# EAGLE schematic BeoModern_schemat (EAGLE 8.6.3)
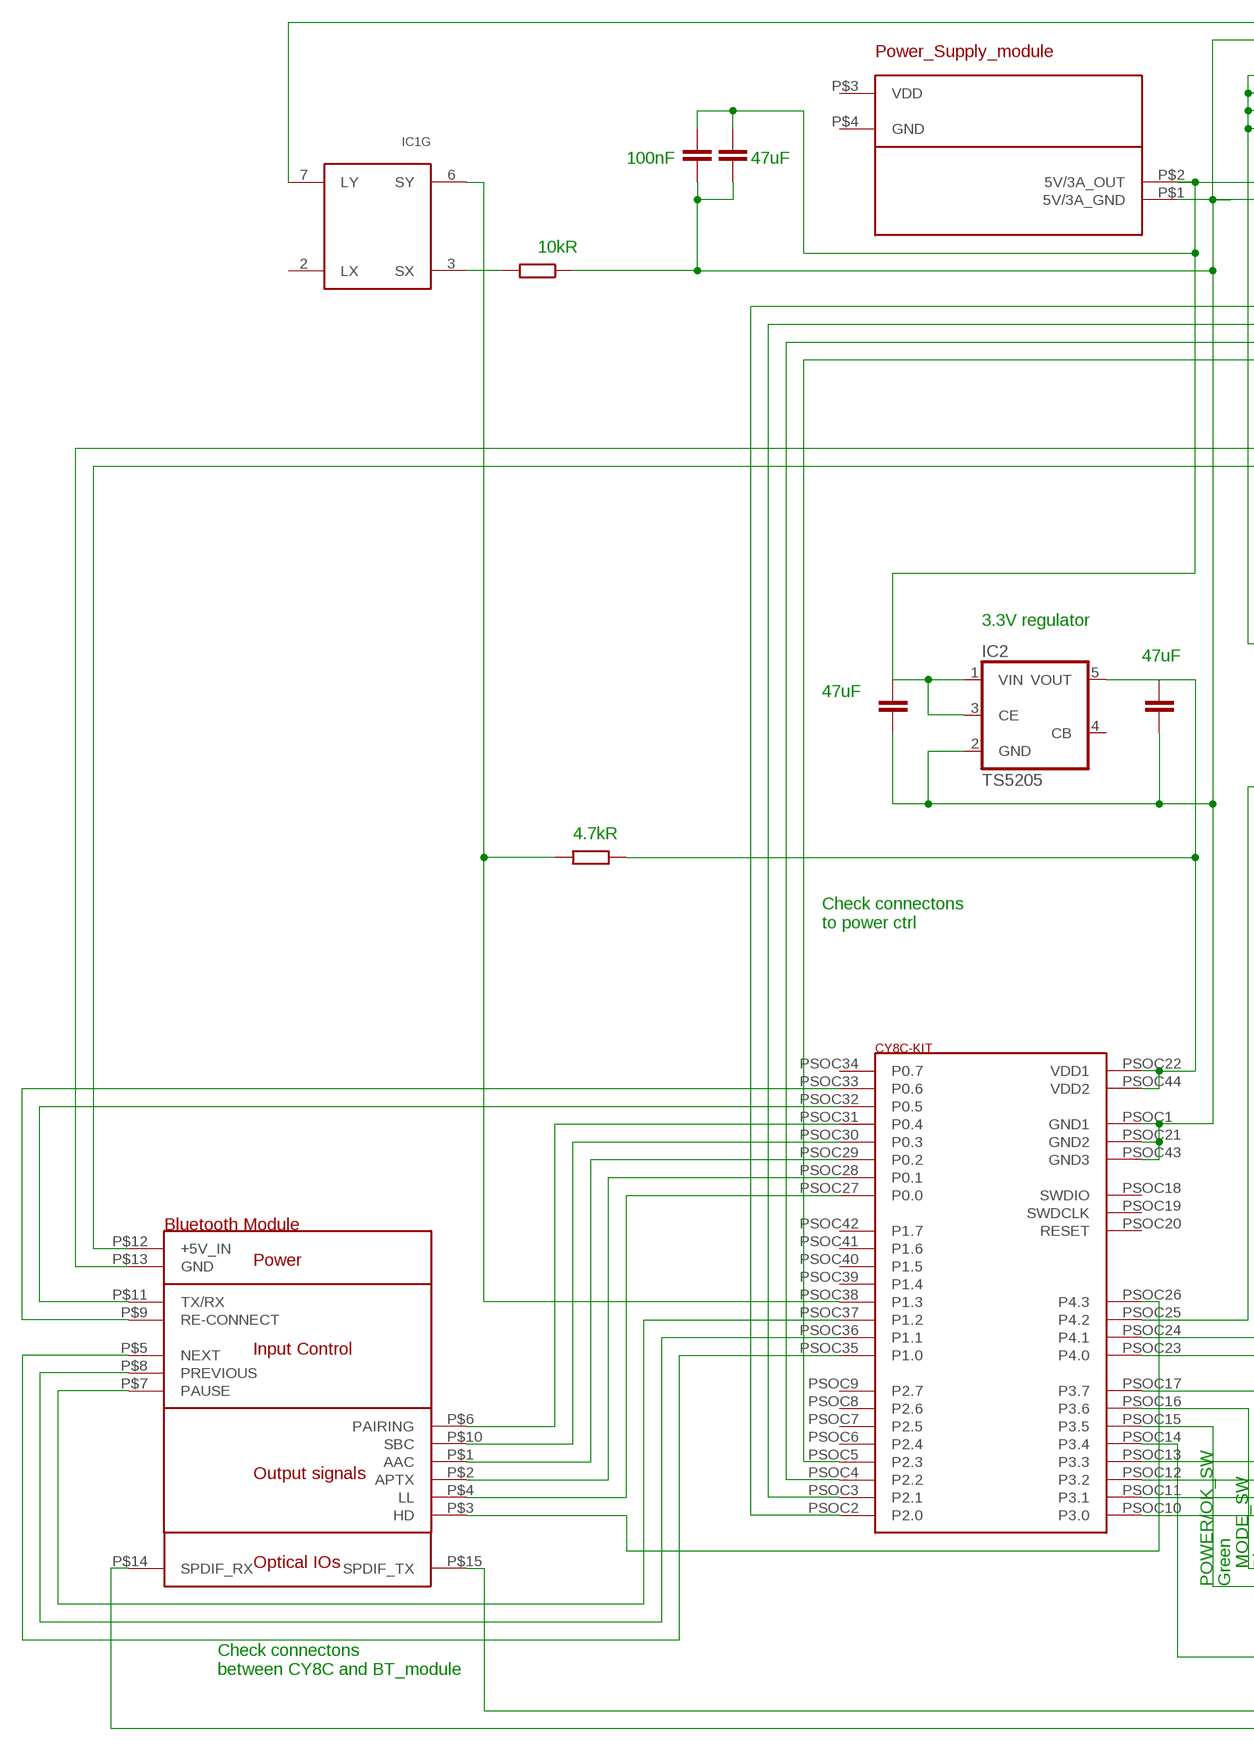
[diagram p0: schematic, sheet 1, part 1 of 2]
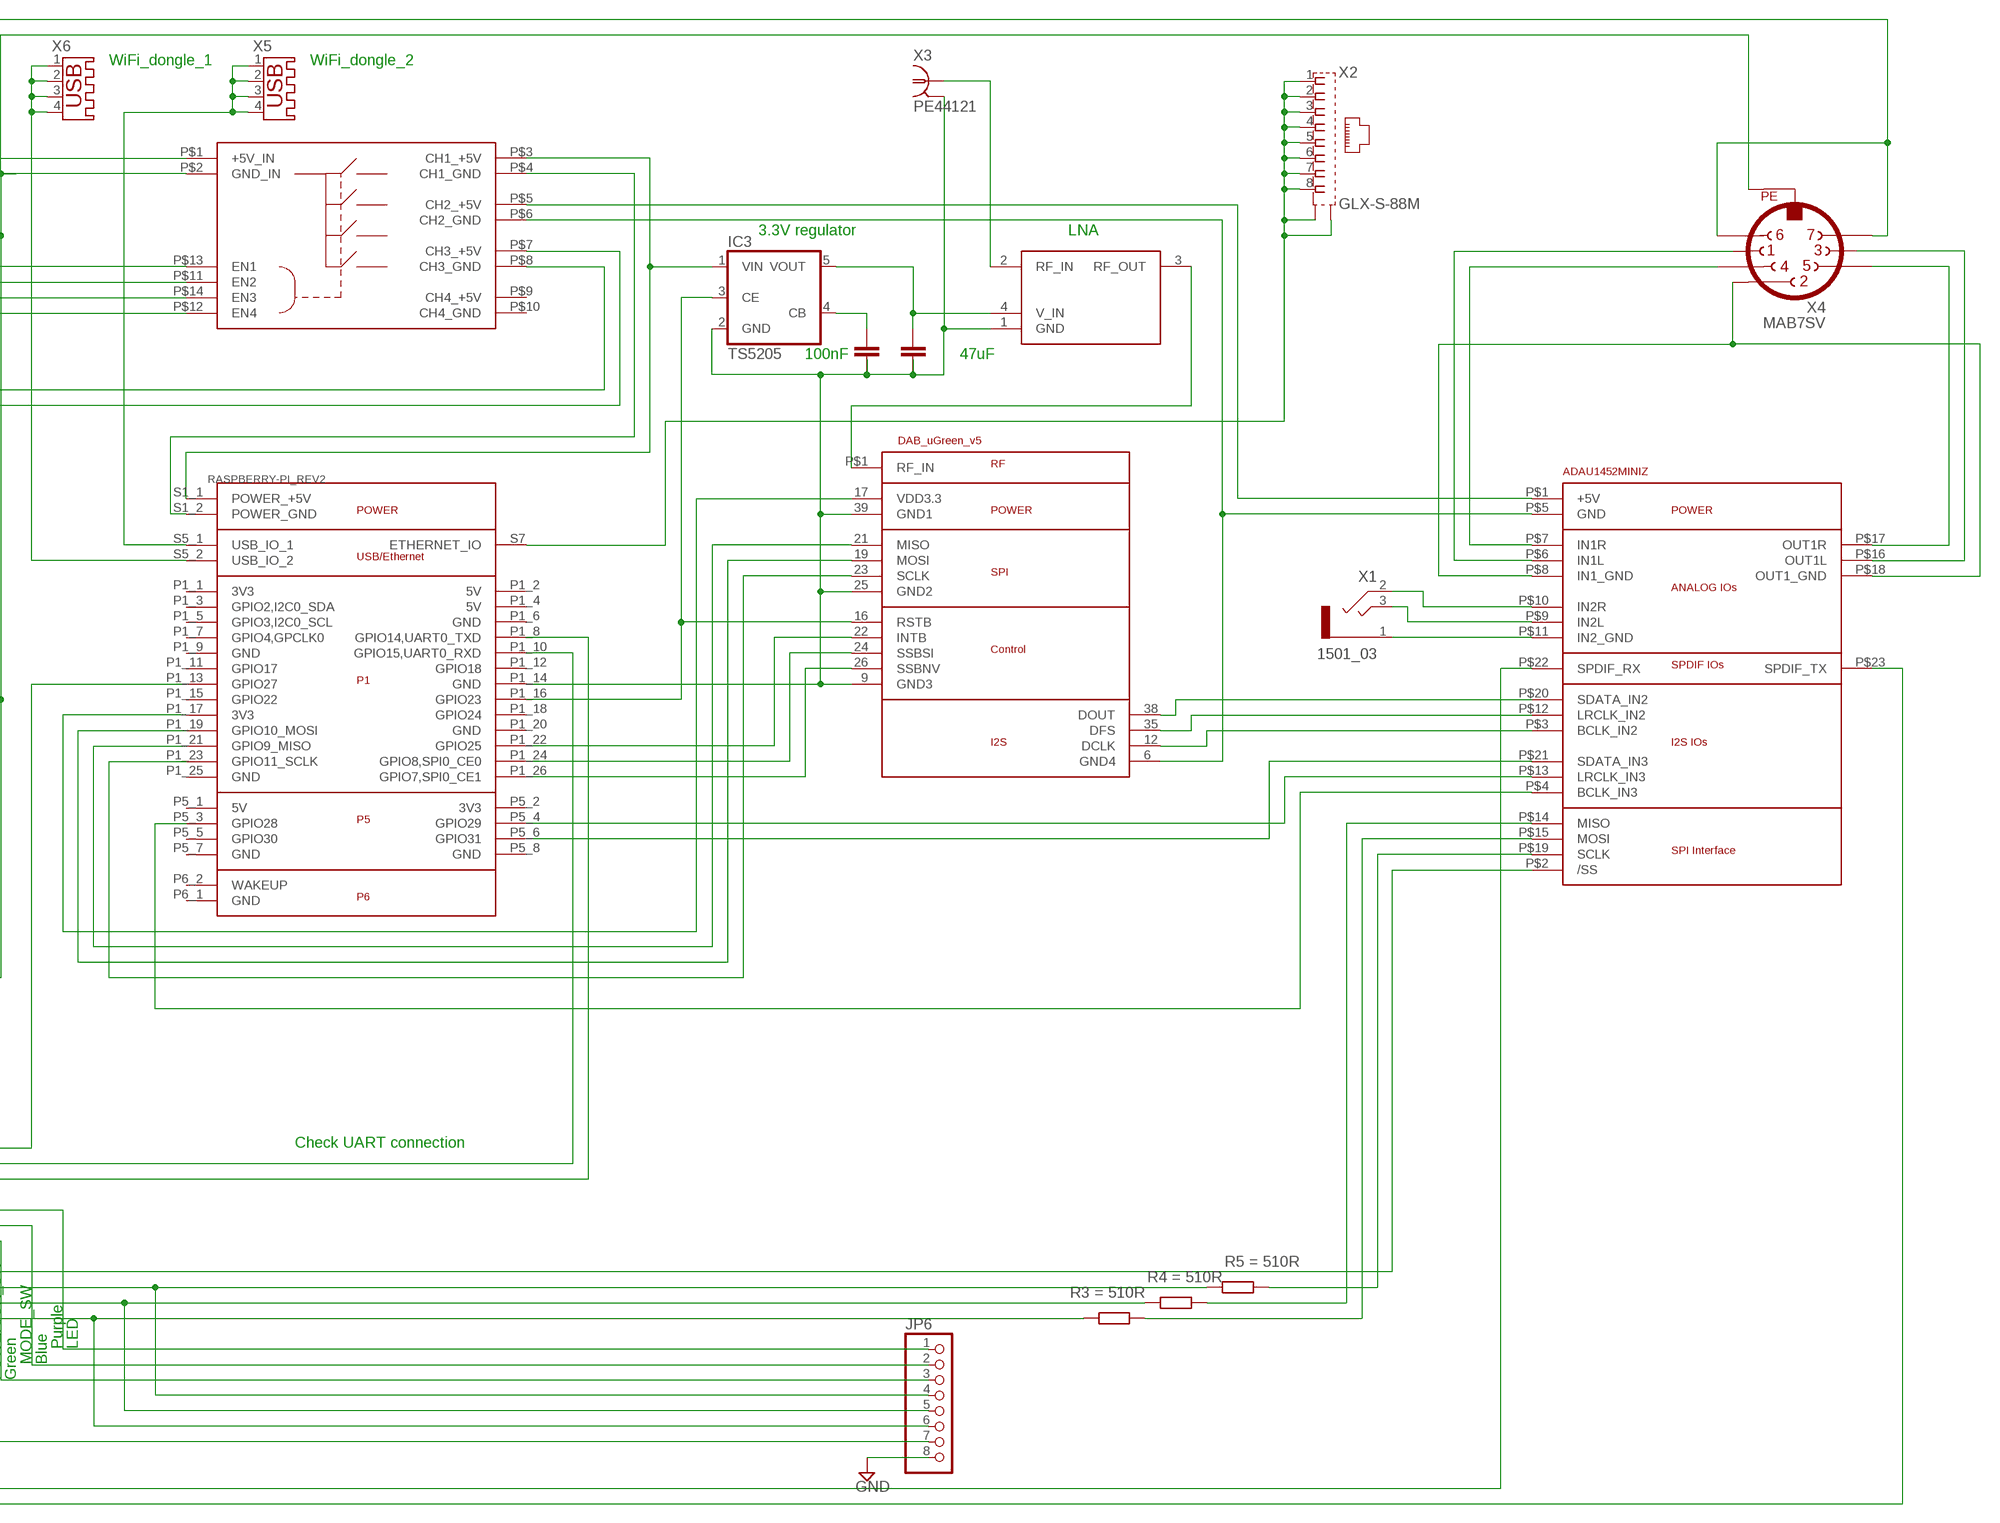
[diagram p1: schematic, sheet 1, part 2 of 2]
R3 (R): R3: 510R
R4 (R): R4: 510R
R5 (R): R5: 510R

## Parts
IC1  82B715TD  [SO8]
IC2  TS5205  [SOT25]
IC3  TS5205  [SOT25]
JP6  PINHD-1X8  [1X08]
U$1  RASPBERRY-PI_REV2  [RASPBERRY-PI_REV2]
U$2  ADAU1452MINIZ  [ADAU1452MINIZ]
U$3  5V_PSU_MODULE  [5V_PSU_MODULE]
U$4  PSU_SWITCH  [PSU_SWITCH]
U$5  DAB_UGREEN_V5  [DAB_UGREEN_V5]
U$6  CY8C-KIT  [CY8C-KIT-FOOTPRINT]
U$7  LNA  [LNA-FOOTPRINT]
U$8  BT_MODULE  [BT_MODULE_FOOTPRINT]
X1  1501_03  [1501_03]
X2  GLX-S-88M  [GLX-S-88M]
X3  PE44121  [PE44121]
X4  MAB7SV  [MAB7SV]
X5  USB-A003  [USB-A003]
X6  USB-A003  [USB-A003]

## Nets
GND: JP6.8
N$1: U$4.P$13(EN1) U$6.PSOC2(P2.0)
N$2: U$4.P$8(CH3_GND) U$8.P$13(GND)
N$3: U$7.2(RF_IN) X3.1
N$4: U$1.S1_2(POWER_GND) U$4.P$4(CH1_GND)
N$5: U$2.P$20(SDATA_IN2) U$5.38(DOUT)
N$6: U$2.P$12(LRCLK_IN2) U$5.35(DFS)
N$7: U$2.P$3(BCLK_IN2) U$5.12(DCLK)
N$8: U$2.P$1(+5V) U$4.P$5(CH2_+5V)
N$9: U$2.P$5(GND) U$4.P$6(CH2_GND) U$5.6(GND4)
N$10: U$1.P1_17(3V3) U$5.17(VDD3.3)
N$11: U$1.P1_26(GPIO7,SPI0_CE1) U$5.26(SSBNV)
N$12: U$1.P1_24(GPIO8,SPI0_CE0) U$5.24(SSBSI)
N$13: U$1.P1_22(GPIO25) U$5.22(INTB)
N$14: U$2.P$11(IN2_GND) X1.1
N$15: U$1.P1_21(GPIO9_MISO) U$5.21(MISO)
N$16: U$1.P1_19(GPIO10_MOSI) U$5.19(MOSI)
N$17: U$1.P1_23(GPIO11_SCLK) U$5.23(SCLK)
N$18: IC3.2(GND) U$1.P1_14(GND) U$5.9(GND3) U$5.25(GND2) U$5.39(GND1) U$7.1(GND) X3.2@1 X3.2@2 X3.2@3 X3.2@4 X3.2@5 X3.2@6
N$19: U$1.P5_3(GPIO28) U$2.P$4(BCLK_IN3)
N$20: U$1.P5_4(GPIO29) U$2.P$13(LRCLK_IN3)
N$21: U$1.P5_6(GPIO31) U$2.P$21(SDATA_IN3)
N$22: U$2.P$16(OUT1L) X4.3
N$23: U$2.P$8(IN1_GND) U$2.P$18(OUT1_GND) X4.2
N$24: U$2.P$17(OUT1R) X4.5
N$25: U$2.P$6(IN1L) X4.1
N$26: U$2.P$7(IN1R) X4.4
N$27: U$4.P$7(CH3_+5V) U$8.P$12(+5V_IN)
N$28: IC1.7(G:LY) X4.6 X4.7
N$29: IC2.2(GND) U$3.P$1(5V/3A_GND) U$4.P$2(GND_IN) U$6.PSOC1(GND1) U$6.PSOC21(GND2) U$6.PSOC43(GND3) X4.PE
N$30: U$4.P$11(EN2) U$6.PSOC3(P2.1)
N$31: U$4.P$14(EN3) U$6.PSOC4(P2.2)
N$32: U$4.P$12(EN4) U$6.PSOC5(P2.3)
N$33: U$1.P1_10(GPIO15,UART0_RXD) U$6.PSOC24(P4.1)
N$34: U$1.P1_8(GPIO14,UART0_TXD) U$6.PSOC23(P4.0)
N$35: U$1.P1_13(GPIO27) U$6.PSOC25(P4.2)
N$36: JP6.6 U$6.PSOC10(P3.0)
N$37: U$2.P$2(/SS) U$6.PSOC13(P3.3)
N$38: JP6.4 U$6.PSOC12(P3.2)
N$39: JP6.7 U$6.PSOC14(P3.4)
N$40: U$2.P$19(SCLK)
N$41: U$2.P$14(MISO)
N$42: JP6.2 U$6.PSOC16(P3.6)
N$43: JP6.1 U$6.PSOC17(P3.7)
N$44: IC2.5(VOUT) U$6.PSOC22(VDD1) U$6.PSOC44(VDD2)
N$45: U$6.PSOC26(P4.3) U$8.P$3(HD)
N$46: IC3.4(CB)
N$47: IC3.1(VIN) U$1.S1_1(POWER_+5V) U$4.P$3(CH1_+5V)
N$48: IC3.3(CE) U$1.P1_16(GPIO23) U$5.16(RSTB)
N$49: U$1.S7(ETHERNET_IO) X2.1 X2.2 X2.3 X2.4 X2.5 X2.6 X2.7 X2.8 X2.S1 X2.S2
N$50: U$5.P$1(RF_IN) U$7.3(RF_OUT)
N$51: IC3.5(VOUT) U$7.4(V_IN)
N$52: IC1.6(G:SY) U$6.PSOC38(P1.3)
N$53: IC1.3(G:SX)
N$54: U$6.PSOC27(P0.0) U$8.P$4(LL)
N$55: U$6.PSOC28(P0.1) U$8.P$2(APTX)
N$56: U$6.PSOC29(P0.2) U$8.P$1(AAC)
N$57: U$6.PSOC30(P0.3) U$8.P$10(SBC)
N$58: U$6.PSOC31(P0.4) U$8.P$6(PAIRING)
N$59: U$6.PSOC32(P0.5) U$8.P$11(TX/RX)
N$60: U$6.PSOC33(P0.6) U$8.P$9(RE-CONNECT)
N$61: U$6.PSOC37(P1.2) U$8.P$7(PAUSE)
N$62: U$6.PSOC36(P1.1) U$8.P$8(PREVIOUS)
N$63: U$6.PSOC35(P1.0) U$8.P$5(NEXT)
N$64: IC2.1(VIN) IC2.3(CE) U$3.P$2(5V/3A_OUT) U$4.P$1(+5V_IN)
N$65: U$2.P$22(SPDIF_RX) U$8.P$15(SPDIF_TX)
N$66: U$2.P$23(SPDIF_TX) U$8.P$14(SPDIF_RX)
N$67: U$1.S5_2(USB_IO_2) X6.1 X6.2 X6.3 X6.4
N$68: U$1.S5_1(USB_IO_1) X5.1 X5.2 X5.3 X5.4
N$69: U$2.P$9(IN2L) X1.3
N$70: U$2.P$10(IN2R) X1.2
N$71: U$2.P$15(MOSI)
N$72: JP6.5 U$6.PSOC11(P3.1)
N$121: JP6.3 U$6.PSOC15(P3.5)
Unconnected: IC1.1(NC:NC) IC1.2(G:LX) IC1.5(NC:NC) IC2.4(CB) U$1.P1_1(3V3) U$1.P1_2(5V) U$1.P1_3(GPIO2,I2C0_SDA) U$1.P1_4(5V) U$1.P1_5(GPIO3,I2C0_SCL) U$1.P1_6(GND) U$1.P1_7(GPIO4,GPCLK0) U$1.P1_9(GND) U$1.P1_11(GPIO17) U$1.P1_12(GPIO18) U$1.P1_15(GPIO22) U$1.P1_18(GPIO24) U$1.P1_20(GND) U$1.P1_25(GND) U$1.P5_1(5V) U$1.P5_2(3V3) U$1.P5_5(GPIO30) U$1.P5_7(GND) U$1.P5_8(GND) U$1.P6_1(GND) U$1.P6_2(WAKEUP) U$3.P$3(VDD) U$3.P$4(GND) U$4.P$9(CH4_+5V) U$4.P$10(CH4_GND) U$6.PSOC6(P2.4) U$6.PSOC7(P2.5) U$6.PSOC8(P2.6) U$6.PSOC9(P2.7) U$6.PSOC18(SWDIO) U$6.PSOC19(SWDCLK) U$6.PSOC20(RESET) U$6.PSOC34(P0.7) U$6.PSOC39(P1.4) U$6.PSOC40(P1.5) U$6.PSOC41(P1.6) U$6.PSOC42(P1.7)

## Notes on the sheet
- WiFi_dongle_1 | WiFi_dongle_2
- 100nF | 47uF
- 10kR
- 3.3V regulator | LNA
- 100nF | 47uF
- 3.3V regulator
- 47uF
- 47uF
- 4.7kR
- Check connectons
  to power ctrl
- Check UART connection
- Purple | LED
- MODE_SW | Blue
- POWER/OK_SW | Green
- Check connectons
  between CY8C and BT_module

## Power pins joined to a net without a drawn wire
GND: IC1.4(P:GND)
VCC: IC1.8(P:VCC)

## Library data of the parts
IC1 = micro-philips:82B715: I2C bus extender; MPN: P82B715TD,118; OC_FARNELL: 1627047; OC_NEWARK: 70R8457
IC2 IC3 = v-reg:TS5205: 150mA Low Noise LDO Voltage Regulator with Enable TSC [Taiwan Semiconductor Company, Ltd] Source: http://www.taiwansemi.com .. 5205_0409c.pdf
JP6 = pinhead:PINHD-1X8: PIN HEADER
U$1 = RaspberryPi:RASPBERRY-PI_REV2: Raspberry Pi Board <http://www.raspberrypi.org/> Jacques Lagnel V1.0 (beta) 2012 Mateusz Bawaj V1.1 (beta) 2012 Board dimension: Forum 3D model <http://www.raspberrypi.org/forum/general-discussion/mechanical-profile-3d-models?value=3d%20model&type=1&include=1&search=1&ret=all> The GPIO Connector (P1): http://elinux.org/RPi_Low-level_peripherals The GPIO Connector (P5): http://www.raspberrypi-spy.co.uk/2012/09/raspberry-pi-p5-header/
U$2 = ADAU1452MINIZ:ADAU1452MINIZ
U$3 = 5V_PSU_MODULE:5V_PSU_MODULE
U$4 = PSU_Switch:PSU_SWITCH
U$5 = DAB_uGreen_v5:DAB_UGREEN_V5
U$6 = CY8C-KIT:CY8C-KIT
U$7 = LNA:LNA
U$8 = BT_MODULE:BT_MODULE
X1 = con-lumberg:1501_03: Klinkensteckverbinder nach JISC 6560, 2,5 mm Jack connectors according to JISC 6560, 2.5 mm Source: http://www.lumberg.com/Produkte/PDFs/1501_03.pdf; OC_FARNELL: 1200127; OC_NEWARK: unknown
X2 = con-kycon:GLX-S-88M: Mod. Jack, Right Angle, 8 posiotion, 8 contatcs RJ45 Source: GLX-S-88M.pdf; OC_FARNELL: unknown; OC_NEWARK: unknown
X3 = con-coax:PE44121: SMB JACK RIGHT ANGLE SURFACE MOUNT Source: http://www.pasternack.com/Pdf/PE44121.pdf; OC_FARNELL: unknown; OC_NEWARK: unknown
X4 = con-hirschmann:MAB7SV: Female CONNECTOR 7 pins 45 deg. with shield, vertical (DIN 45329); OC_FARNELL: unknown; OC_NEWARK: unknown
X5 X6 = con-yamaichi:USB-A003: USB connector; OC_FARNELL: unknown; OC_NEWARK: unknown